# Altium schematic sheet FDCAN-ISO.SchDoc
size 209 x 148 mm; SheetNumber: 4; SheetTotal: 4
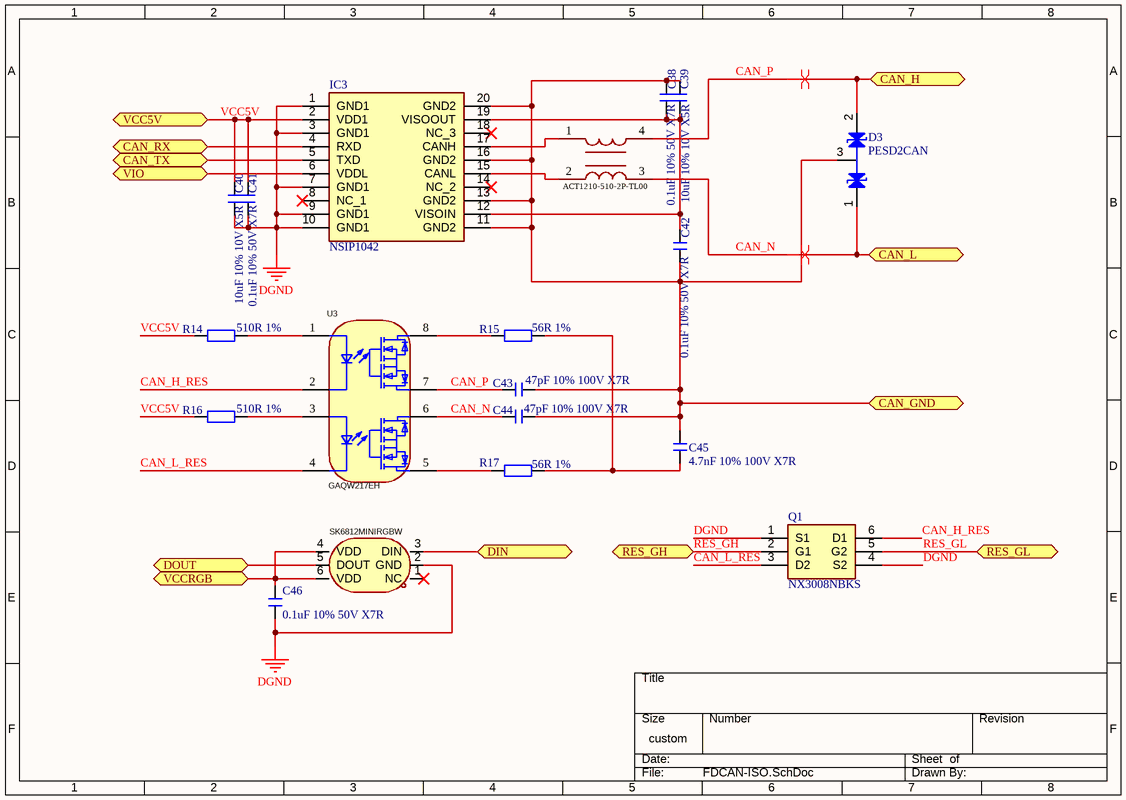
[diagram p0: FDCAN-ISO.SchDoc]

## Parts
C38  0.1uF 10% 50V X7R  [C 0603_L]
C39  10uF 10% 10V X5R  [C 0603_L]
C40  10uF 10% 10V X5R  [C 0603_L]
C41  0.1uF 10% 50V X7R  [C 0603_L]
C42  0.1uF 10% 50V X7R  [C 0603_L]
C43  47pF 10% 100V X7R  [C 0603_L]
C44  47pF 10% 100V X7R  [C 0603_L]
C45  4.7nF 10% 100V X7R  [C 0603_L]
C46  0.1uF 10% 50V X7R  [C 0603_L]
D3  PESD2CAN  [SOT23-3L]
IC3  NSIP1042  [SOP20]
L4  ACT1210-510-2P-TL00  [SMD_4P-L3.2-W2.5]
LED2  SK6812MINIRGBW  [LED-ARRAY-SMD_6P-L3.7-W3.5]
Q1  NX3008NBKS  [SOT-363]
R14  510R 1%  [R 0603_L]
R15  56R 1%  [R 0603_L]
R16  510R 1%  [R 0603_L]
R17  56R 1%  [R 0603_L]
U3  GAQW217EH  [SMD-8_L9.9-W6.4-P2.54-LS10.0-BR]

## Ports
CAN_GND (bidir, see VCAN[2D]), CAN_H (bidir, see VCAN[2D]), CAN_L (bidir, see VCAN[2D]), CAN_RX (bidir, see VCAN[3D]), CAN_TX (bidir, see VCAN[3D]), DIN (bidir, see VCAN[2C]), DOUT (bidir, see VCAN[2C]), RES_GH (bidir, see VCAN[3C]), RES_GL (bidir, see VCAN[3C]), VCC5V (bidir, see VCAN[3D], Power[3C]), VCCRGB (bidir, see VCAN[2D]), VIO (bidir, see VCAN[3D])

## Nets
DGND: C40.2 C41.1 C46.1 IC3.1(GND1) IC3.3(GND1) IC3.7(GND1) IC3.9(GND1) IC3.10(GND1) LED2.2(GND) Q1.1(S1) Q1.4(S2)
CAN_GND: C38.2 C39.1 C42.1 C43.2 C44.1 C45.1 D3.3 IC3.11(GND2) IC3.13(GND2) IC3.16(GND2) IC3.20(GND2) ; port CAN_GND
CAN_H_RES: Q1.6(D1) U3.2
CAN_L_RES: Q1.3(D2) U3.4
CAN_N: C44.2 D3.1 L4.3 U3.6 ; port CAN_L
CAN_P: C43.1 D3.2 L4.4 U3.7 ; port CAN_H
CAN_RX: IC3.4(RXD) ; port CAN_RX
CAN_TX: IC3.5(TXD) ; port CAN_TX
DIN: LED2.3(DIN) ; port DIN
DOUT: LED2.5(DOUT) ; port DOUT
RES_GH: Q1.2(G1) ; port RES_GH
RES_GL: Q1.5(G2) ; port RES_GL
VCC5V: C40.1 C41.2 IC3.2(VDD1) R14.2 R16.2 ; port VCC5V
VCCRGB: C46.2 LED2.4(VDD) LED2.6(VDD) ; port VCCRGB
VIO: IC3.6(VDDL) ; port VIO
NetC38_1: C38.1 C39.2 C42.2 IC3.12(VISOIN) IC3.19(VISOOUT)
NetC45_2: C45.2 R15.1 R17.2
NetIC3_15: IC3.15(CANL) L4.2
NetIC3_17: IC3.17(CANH) L4.1
NetR14_1: R14.1 U3.1
NetR15_2: R15.2 U3.8
NetR16_1: R16.1 U3.3
NetR17_1: R17.1 U3.5

Not connected (* = marked no-connect by the designer): IC3 8(NC_1)* 14(NC_2)* 18(NC_3)*; LED2 1(NC)*

## Layout directives
differential pair: CAN_N, CAN_P

## Library data of the parts
C38-C46 = C: 贴片电容
IC3 = NSIP1042: Integrated Circuit; Manufacturer_Name: NOVOSENSE; Datasheet Link: https://www.novosns.com/files/NSiP1042_Datasheet_Rev1.0_EN.pdf; Height: 2.65mm; Manufacturer_Part_Number: NSIP1042
L4 = ACT1210-510-2P-TL00: Manufacturer: TDK; Symbol: ACT45B-510-2P-TL003; Add into BOM: yes; Number of Lines: 2; Withstanding Voltage: 250V@2secs; Current Rating: 200mA; Inductance @ Frequency: 51uH@100kHz; Voltage Rating - DC: 50V; Impedance @ Frequency: 2.8kΩ@10MHz; DC Resistance (DCR): 1Ω; Device: ACT45B-510-2P-TL003; LCSC Part Name: 两路 4532共模滤波器 阻抗2.8kΩ@10MHz; Supplier Part: C76584; Manufacturer Part: ACT45B-510-2P-TL003; Supplier Footprint: SMD,4.5x3.2mm; JLCPCB Part Class: Extended Part; Datasheet: https://atta.szlcsc.com/upload/public/pdf/source/20160918/1474166842057.pdf; Supplier: LCSC; Convert to PCB: yes; Voltage Rating: -; Operating Temperature: -40℃~+150℃
LED2 = SK6812MINIRGBW-BW-P6-A: Manufacturer: 欧思科光电; Add into BOM: yes; Symbol: SK6812MINIRGBW-BW-P6-A; Device: SK6812MINIRGBW-BW-P6-A; LCSC Part Name: SK6812MINIRGBW-BW-P6-A; Supplier Part: C7423105; Manufacturer Part: SK6812MINIRGBW-BW-P6-A; Supplier Footprint: SMD,3.5x3.7mm; JLCPCB Part Class: Extended Part; Datasheet: https://atta.szlcsc.com/upload/public/pdf/source/20230612/4DBDBEE6CD9AD57889E7B23729FE64E4.pdf; Supplier: LCSC; Convert to PCB: yes
Q1 = NX3008NBKS: MOSFET (N-Channel); Manufacturer_Name: Nexperia; Manufacturer_Part_Number: NX3008NBKS,115; Datasheet Link: https://assets.nexperia.com/documents/data-sheet/NX3008NBKS.pdf; Height: 1.1mm; Mouser Part Number: 771-NX3008NBKS,115; Mouser Price/Stock: https://www.mouser.co.uk/ProductDetail/Nexperia/NX3008NBKS115?qs=N31o%252Bt096gvSMWdFEcaa8A%3D%3D; Arrow Part Number: NX3008NBKS,115; Arrow Price/Stock: https://www.arrow.com/en/products/nx3008nbks115/nexperia?utm_currency=USD&region=nac
R14-R17 = R: 贴片电阻
U3 = GAQW217EH: Manufacturer: SUPSiC(国晶微半导体); Add into BOM: yes; Forward Current(If): 7mA; Voltage - Forward(Vf): 1.2V; Load Voltage: 200V; Load Current: 200mA; RDS(on): 5Ω; Isolation Voltage(Vrms): 5kV; Turn-on time: 400us; Turn-off time: 50us; Symbol: GAQW217EH; Device: GAQW217EH; LCSC Part Name: GAQW217EH; Supplier Part: C42463227; Manufacturer Part: GAQW217EH; Supplier Footprint: SMD-8P; JLCPCB Part Class: Extended Part; Datasheet: https://atta.szlcsc.com/upload/public/pdf/source/20250211/599B2BE388980A1F19AA516DEECC9227.pdf; Supplier: LCSC; Convert to PCB: yes; Operating Temperature: -40℃~+85℃